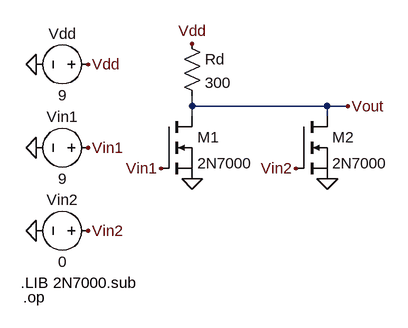
[diagram p0: schematic PreLab2.asc]
PreLab2.asc, the LTspice schematic file:
Version 4
SHEET 1 880 680
WIRE 192 -96 192 -112
WIRE 400 -96 192 -96
WIRE 432 -96 400 -96
WIRE 192 -80 192 -96
WIRE 400 -80 400 -96
FLAG -48 96 0
FLAG -48 -32 0
FLAG -48 -160 0
FLAG 32 -160 Vdd
FLAG 32 -32 Vin1
FLAG 32 96 Vin2
FLAG 144 0 Vin1
FLAG 352 0 Vin2
FLAG 432 -96 Vout
FLAG 192 -192 Vdd
FLAG 400 16 0
FLAG 192 16 0
DATAFLAG 304 -96 ""
SYMBOL voltage 48 -160 R90
WINDOW 0 -32 56 VBottom 2
WINDOW 3 32 56 VTop 2
WINDOW 123 0 0 Left 0
WINDOW 39 0 0 Left 0
SYMATTR InstName Vdd
SYMATTR Value 9
SYMBOL voltage 48 -32 R90
WINDOW 0 -32 56 VBottom 2
WINDOW 3 32 56 VTop 2
WINDOW 123 0 0 Left 0
WINDOW 39 0 0 Left 0
SYMATTR InstName Vin1
SYMATTR Value 9
SYMBOL voltage 48 96 R90
WINDOW 0 -32 56 VBottom 2
WINDOW 3 32 56 VTop 2
WINDOW 123 0 0 Left 0
WINDOW 39 0 0 Left 0
SYMATTR InstName Vin2
SYMATTR Value 0
SYMBOL res 176 -208 R0
SYMATTR InstName Rd
SYMATTR Value 300
SYMBOL nmos 144 -80 R0
SYMATTR InstName M1
SYMATTR Value 2N7000
SYMBOL nmos 352 -80 R0
SYMATTR InstName M2
SYMATTR Value 2N7000
TEXT -68 198 Left 2 !.op
TEXT -72 176 Left 2 !.LIB 2N7000.sub

The netlist it stands for:
* PreLab2.asc
Vdd Vdd 0 9
Vin1 Vin1 0 9
Vin2 Vin2 0 0
Rd Vdd Vout 300
M1 Vout Vin1 0 0 2N7000
M2 Vout Vin2 0 0 2N7000
.model NMOS NMOS
.model PMOS PMOS
.lib standard.mos
.op
.LIB 2N7000.sub
.backanno
.end

* Results of the author's LTspice run, read from the files saved beside the schematic
* Operating Point:
*   V(vdd) = 9 V
*   V(vin1) = 9 V
*   V(vin2) = 0 V
*   V(vout) = 57.47 mV
*   Id(M2) = 123.9 fA
*   Ig(M2) = 0 A
*   Ib(M2) = -66.39 fA
*   Is(M2) = -57.47 fA
*   Id(M1) = 29.81 mA
*   Ig(M1) = 0 A
*   Ib(M1) = -67.14 fA
*   Is(M1) = -29.81 mA
*   I(Rd) = 29.81 mA
*   I(Vin2) = 0 A
*   I(Vin1) = 0 A
*   I(Vdd) = -29.81 mA
* From the log:
*   Semiconductor Device Operating Points:
*                           --- MOSFET Transistors ---
*   Name:          m2          m1
*   Model:       2n7000      2n7000
*   Id:          1.24e-13    2.98e-02
*   Vgs:         0.00e+00    9.00e+00
*   Vds:         5.75e-02    5.75e-02
*   Vbs:         0.00e+00    0.00e+00
*   Vth:         1.95e+00    1.95e+00
*   Vdsat:       3.59e-02    6.19e+00
*   Gm:          2.78e-24    4.22e-03
*   Gds:         9.42e-27    6.71e-01
*   Gmb:         1.55e-24    8.52e-04
*   Cbd:         0.00e+00    0.00e+00
*   Cbs:         0.00e+00    0.00e+00
*   Cgsov:       7.27e-11    7.27e-11
*   Cgdov:       2.54e-11    2.54e-11
*   Cgbov:       0.00e+00    0.00e+00
*   Cgs:         0.00e+00    3.46e-12
*   Cgd:         0.00e+00    3.44e-12
*   Cgb:         6.90e-12    0.00e+00